# EAGLE design scanimage-bias (EAGLE 7.5.0)
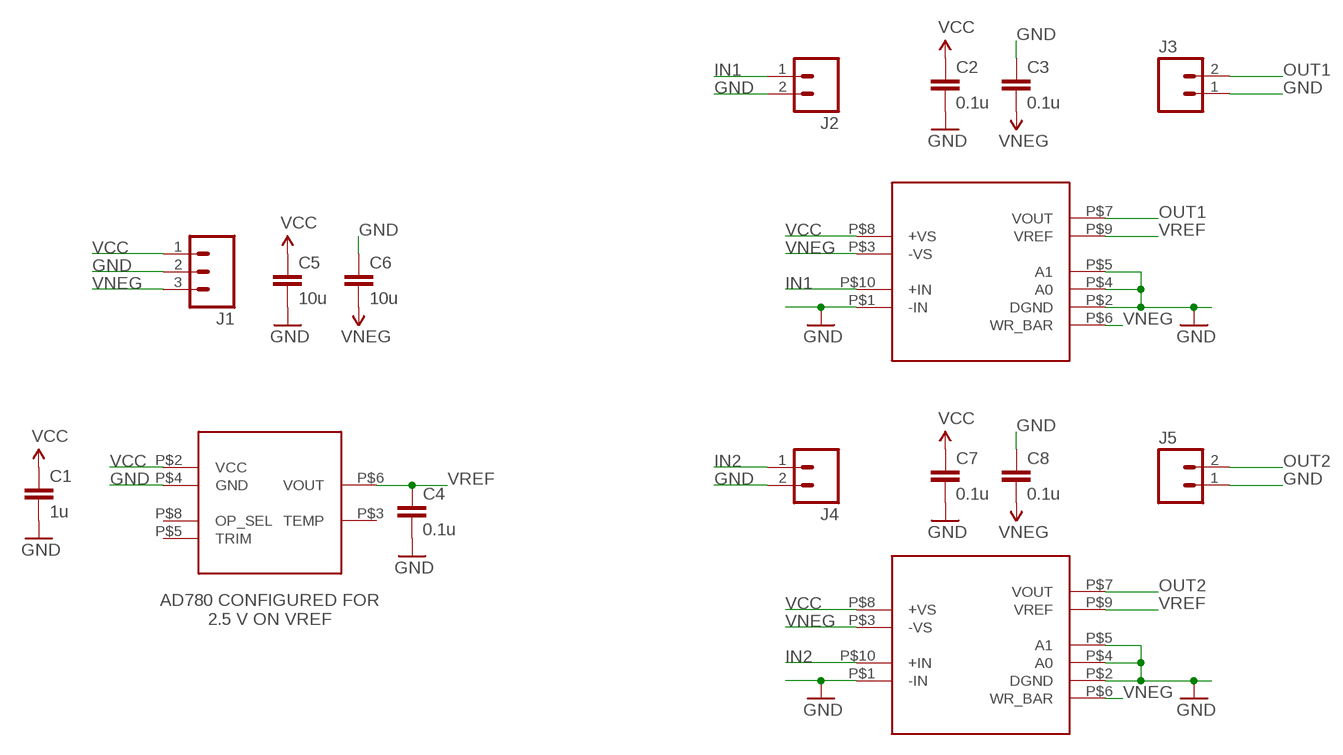
[diagram p0: schematic, sheet 1]

## Parts
C1  1u  CAP1206  [1206]
C2  0.1u  CAP1206  [1206]
C3  0.1u  CAP1206  [1206]
C4  0.1u  CAP1206  [1206]
C5  10u  CAP1206  [1206]
C6  10u  CAP1206  [1206]
C7  0.1u  CAP1206  [1206]
C8  0.1u  CAP1206  [1206]
J1  M03PTH  [1X03]
J2  M02PTH  [1X02]
J3  M02PTH  [1X02]
J4  M02PTH  [1X02]
J5  M02PTH  [1X02]
U$1  AD780  [SOIC-8]
U$2  AD8250  [MSOP-10]
U$3  AD8250  [MSOP-10]

## Nets
GND: C1.2 C2.2 C3.1 C4.2 C5.2 C6.1 C7.2 C8.1 J1.2 J2.2 J3.1 J4.2 J5.1 U$1.P$4(GND) U$2.P$1(-IN) U$2.P$2(DGND) U$2.P$4(A0) U$2.P$5(A1) U$3.P$1(-IN) U$3.P$2(DGND) U$3.P$4(A0) U$3.P$5(A1)
IN1: J2.1 U$2.P$10(+IN)
IN2: J4.1 U$3.P$10(+IN)
OUT1: J3.2 U$2.P$7(VOUT)
OUT2: J5.2 U$3.P$7(VOUT)
VCC: C1.1 C2.1 C5.1 C7.1 J1.1 U$1.P$2(VCC) U$2.P$8(+VS) U$3.P$8(+VS)
VNEG: C3.2 C6.2 C8.2 J1.3 U$2.P$3(-VS) U$2.P$6(WR_BAR) U$3.P$3(-VS) U$3.P$6(WR_BAR)
VREF: C4.1 U$1.P$6(VOUT) U$2.P$9(VREF) U$3.P$9(VREF)
Unconnected: U$1.P$3(TEMP) U$1.P$5(TRIM) U$1.P$8(OP_SEL)

## Notes on the sheet
- AD780 CONFIGURED FOR
  2.5 V ON VREF

## Library data of the parts
C1-C8 = SparkFun-Capacitors:CAP: Capacitor Standard 0603 ceramic capacitor, and 0.1" leaded capacitor.
J1 = SparkFun-Connectors:M03: Header 3 Standard 3-pin 0.1" header. Use with straight break away headers (SKU : PRT-00116), right angle break away headers (PRT-00553), swiss pins (PRT-00743), machine pins (PRT-00117), and female headers (PRT-00115). Molex polarized connector foot print use with SKU : PRT-08232 with associated crimp pins and housings.
J2-J5 = SparkFun-Connectors:M02: Standard 2-pin 0.1" header. Use with - straight break away headers ( PRT-00116) - right angle break away headers (PRT-00553) - swiss pins (PRT-00743) - machine pins (PRT-00117) - female headers (PRT-00115) Molex polarized connector foot print use with: PRT-08233 with associated crimp pins and housings. 2.54_SCREWTERM for use with PRT-10571. 3.5mm Screw Terminal footprints for PRT-08084 5mm Screw Terminal footprints for use with PRT-08432
U$1 = kimth:AD780
U$2 U$3 = kimth:AD8250

## Board
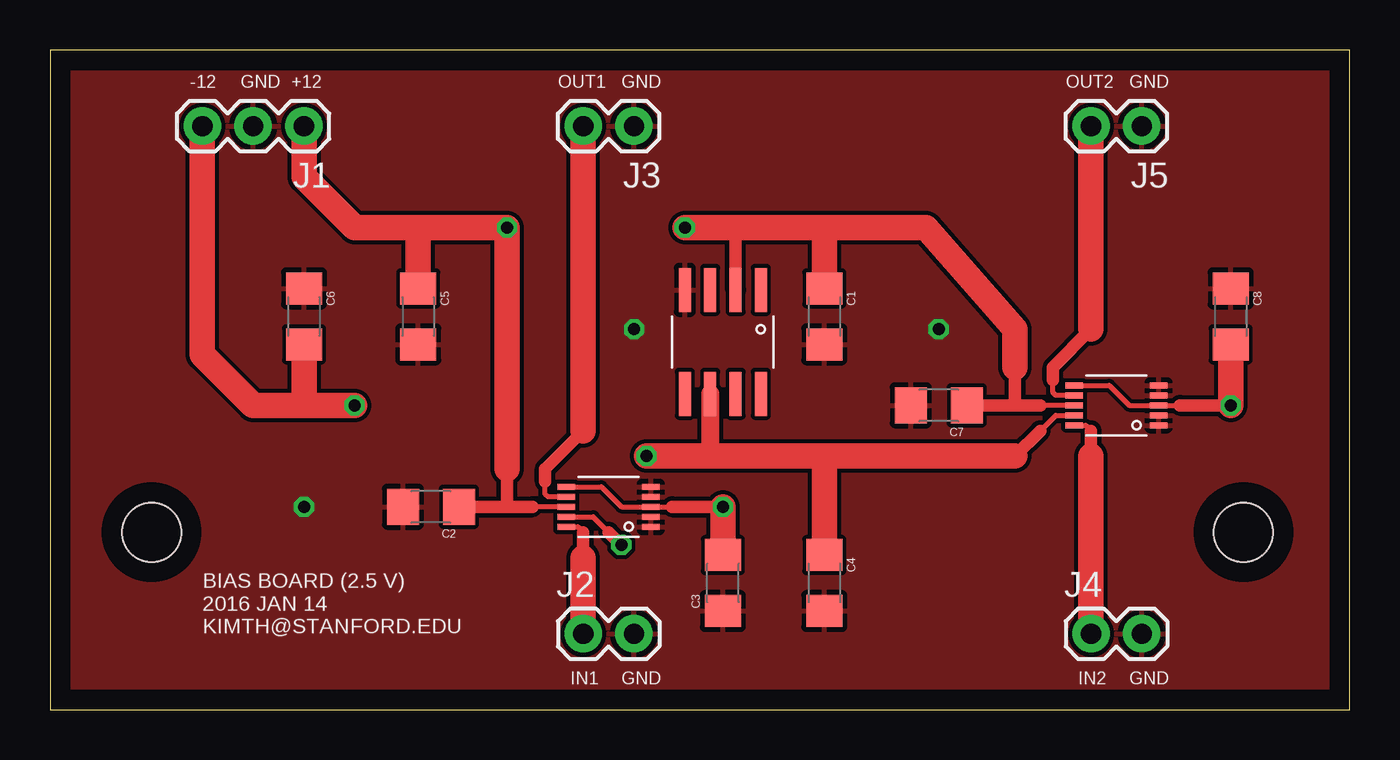
[diagram p1: board, top side]
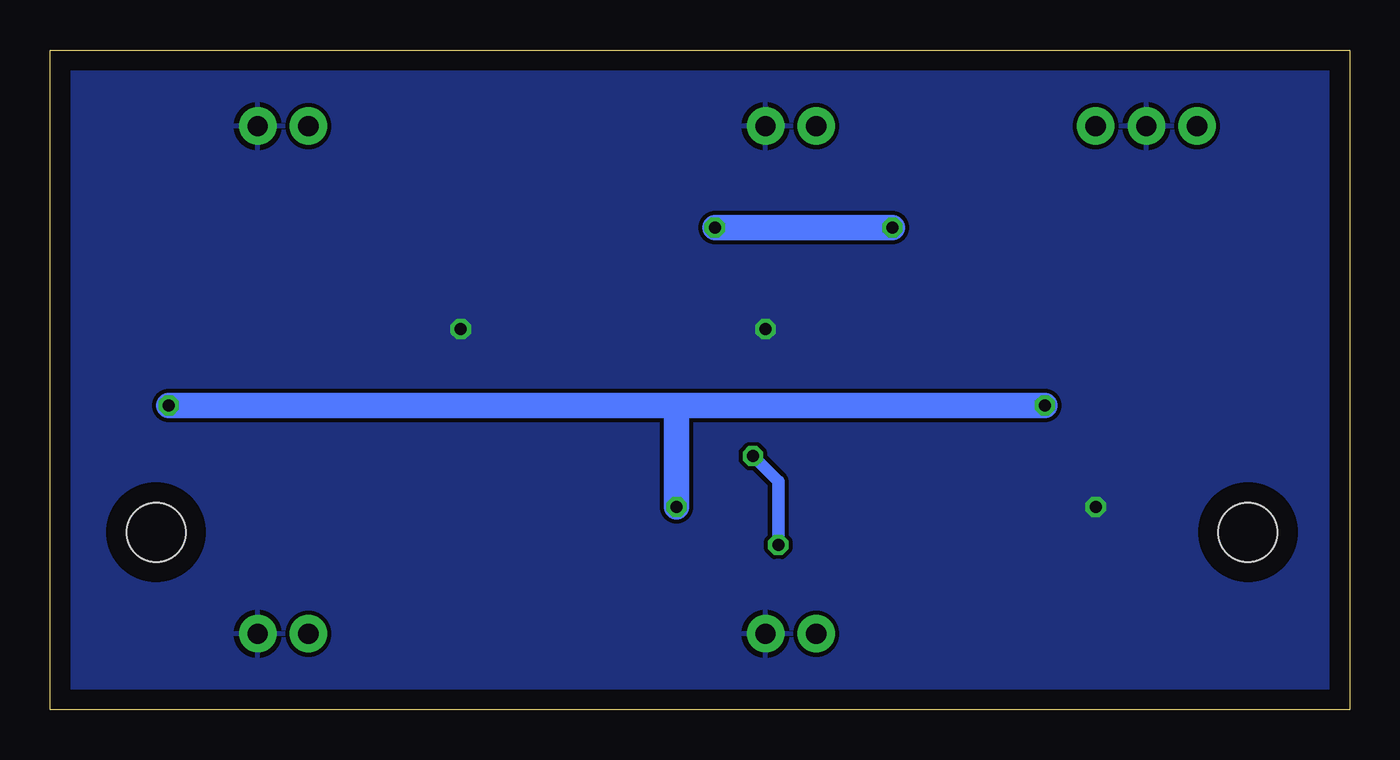
[diagram p2: board, bottom side, seen from below]

Size 65 x 33.02 mm. Coordinates in mm from the lower left corner, seen from the top.
Outline: 0,0 65,0 65,33.02 0,33.02 0,0
Copper layers (1*16): Top 0.035mm / dielectric 1.5mm / Bottom 0.035mm
Design rules "default": minimum track width 10mil, minimum drill 24mil, track to track 8mil, track to pad 8mil, pad to pad 8mil, via to via 8mil, smd to smd 8mil, copper to edge 40mil, drill to drill 8mil, minimum pad ring 10mil, minimum via ring 8mil, stop-mask expansion 4mil, vias tented up to drill 0mil, thermal gap 10mil
Holes 2.95 mm at 5.08,8.89 59.69,8.89

### Footprints (pad centres in the part's own frame; a part is rotated, then mirrored left to right if it is on the bottom)
1206 = smd 1.6 x 1.8: 1 -1.4,0; 2 1.4,0
1X03 = drill 1.016 pad 1.88: 1 0,0; 2 2.54,0; 3 5.08,0
1X02 = drill 1.016 pad 1.88: 1 0,0; 2 2.54,0
SOIC-8 = smd 2.2 x 0.6: P$1 -2.6,1.905; P$2 -2.6,0.635; P$3 -2.6,-0.635; P$4 -2.6,-1.905; P$5 2.6,-1.905; P$6 2.6,-0.635; P$7 2.6,0.635; P$8 2.6,1.905
MSOP-10 = smd 0.305 x 0.889: P$1 -1,-2.11; P$2 -0.5,-2.11; P$3 0,-2.11; P$4 0.5,-2.11; P$5 1,-2.11; P$6 1,2.11; P$7 0.5,2.11; P$8 0,2.11; P$9 -0.5,2.11; P$10 -1,2.11

### Placement (x,y rotation side)
C1  38.73,19.68 270 top
C2  19.05,10.16 180 top
C3  33.66,6.35 90 top
C4  38.73,6.35 270 top
C5  18.41,19.68 270 top
C6  12.7,19.68 270 top
C7  44.45,15.24 180 top
C8  59.05,19.68 270 top
J1  12.7,29.21 180 top
J2  26.67,3.81 0 top
J3  29.21,29.21 180 top
J4  52.07,3.81 0 top
J5  54.61,29.21 180 top
U$1  33.66,18.41 270 top
U$2  27.94,10.16 90 top
U$3  53.34,15.24 90 top

### Tracks (layer width: path | path; a pad name or v marks a point on that pad's centre or on a via)
GND  (via drill 0.6)
  other vias: 44.45,19.05 29.21,19.05 12.7,10.16
  pour Top: 0,33.02 65,33.02 65,0 0,0
  pour Bottom: 0,33.02 65,33.02 65,0 0,0
IN1
  Top 0.254: U$2.P$10 26.4,9.16 26.67,8.89
  Top 0.635: 26.67,8.89 26.67,7.62
  Top 1.27: 26.67,7.62 J2.1
IN2
  Top 0.254: U$3.P$10 51.8,14.24 52.07,13.97
  Top 0.635: 52.07,13.97 52.07,12.7
  Top 1.27: 52.07,12.7 J4.1
OUT1
  Top 0.254: U$2.P$7 24.9,10.66 24.77,10.79 24.77,11.43
  Top 0.635: 24.77,11.43 24.77,12.06 26.67,13.97
  Top 1.27: 26.67,13.97 J3.2
OUT2
  Top 0.254: U$3.P$7 50.3,15.74 50.16,15.88 50.16,16.51
  Top 0.635: 50.16,16.51 50.16,17.14 52.07,19.05
  Top 1.27: 52.07,19.05 J5.2
VCC  (via drill 0.6)
  Top 0.254: U$3.P$8 49.53,15.24 | U$2.P$8 24.13,10.16
  Top 0.635: U$1.P$2 34.29,24.13 | 49.53,15.24 48.26,15.24 | 48.26,15.24 C7.1 | 48.26,17.14 48.26,15.24 | C2.1 22.86,10.16 | 22.86,10.16 22.86,12.06 | 22.86,10.16 24.13,10.16
  Top 1.27: 38.73,24.13 43.81,24.13 48.26,19.05 48.26,17.14 | 38.73,24.13 34.29,24.13 v31.75,24.13 | C1.1 38.73,24.13 | 18.41,24.13 15.24,24.13 12.7,26.67 J1.1 | 18.41,24.13 v22.86,24.13 22.86,12.06 | C5.1 18.41,24.13
  Bottom 1.27: v31.75,24.13 v22.86,24.13
VNEG  (via drill 0.6)
  Top 0.254: 56.52,15.24 U$3.P$3 53.98,15.24 52.98,16.24 U$3.P$6 | 31.11,10.16 U$2.P$3 28.57,10.16 27.57,11.16 U$2.P$6
  Top 0.635: 31.11,10.16 v33.66,10.16 | 56.52,15.24 v59.05,15.24
  Top 1.27: J1.3 7.62,17.78 10.16,15.24 12.7,15.24 | 12.7,15.24 v15.24,15.24 | v33.66,10.16 C3.2 | v59.05,15.24 C8.2 | C6.2 12.7,15.24
  Bottom 1.27: v15.24,15.24 33.66,15.24 | 33.66,15.24 v33.66,10.16 | 33.66,15.24 v59.05,15.24
VREF  (via drill 0.6)
  Top 0.254: U$3.P$9 50.3,14.74 49.53,13.97 | U$2.P$9 27.17,9.66 27.94,8.89
  Top 0.635: 27.94,8.89 v28.57,8.26 | 49.53,13.97 48.26,12.7
  Top 0.889: U$1.P$6 33.02,12.7
  Top 1.27: v29.84,12.7 33.02,12.7 38.73,12.7 | 38.73,12.7 48.26,12.7 | C4.1 38.73,12.7
  Bottom 0.635: v28.57,8.26 28.57,11.43 v29.84,12.7

### Text on the board
tNames: -12 | GND | +12 | OUT1 | GND | OUT2 | GND | BIAS BOARD (2.5 V) / 2016 JAN 14 / KIMTH@STANFORD.EDU | IN1 | GND | IN2 | GND